# Altium schematic sheet MCU_Pins.SchDoc
size A4 portrait
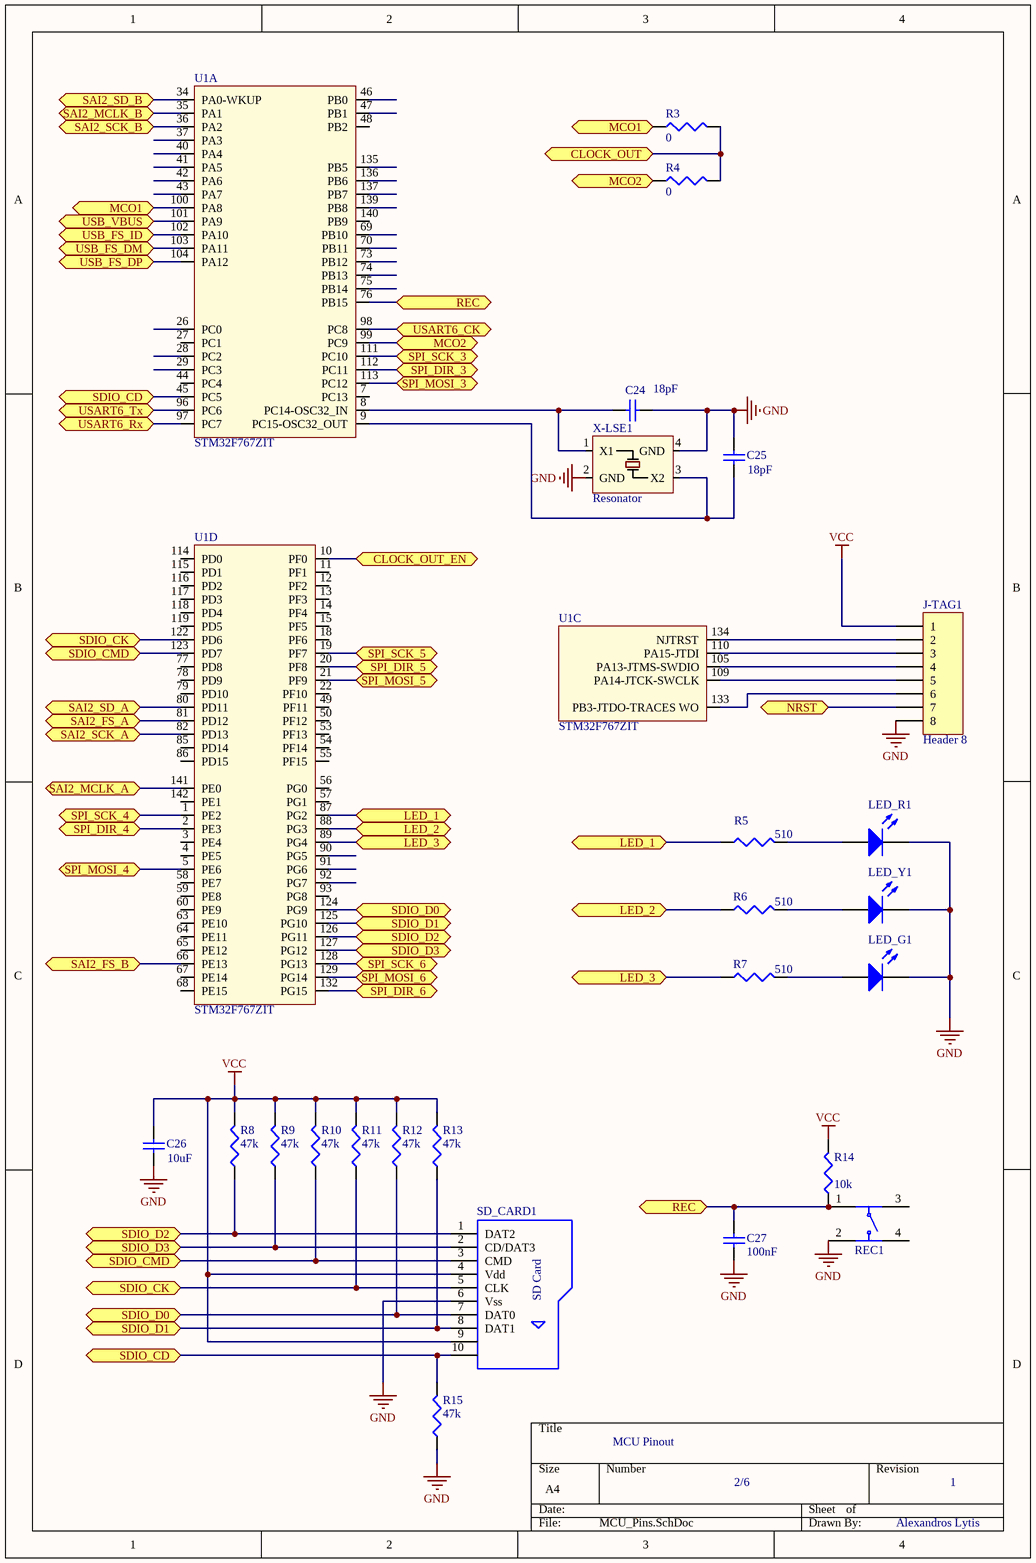
[diagram p0: MCU_Pins.SchDoc]

## Parts
C24  value 18pF  [CAP0603]  (hidden comment: Cap Semi)
C25  value 18pF  [CAP0603]  (hidden comment: Cap Semi)
C26  value 10uF  [CAP0603]  (hidden comment: Cap Semi)
C27  value 100nF  [CAP0603]  (hidden comment: Cap Semi)
J-TAG1  Header 8  [HDR1X8]
LED_G1  LED2  [1608[0603]]  (value not drawn)
LED_R1  LED2  [1608[0603]]  (value not drawn)
LED_Y1  LED2  [1608[0603]]  (value not drawn)
R3  value 0  [RES0603]  (hidden comment: Res3)
R4  value 0  [RES0603]  (hidden comment: Res3)
R5  value 510  [RES0603]  (hidden comment: Res3)
R6  value 510  [RES0603]  (hidden comment: Res3)
R7  value 510  [RES0603]  (hidden comment: Res3)
R8  value 47k  [RES0603]  (hidden comment: Res3)
R9  value 47k  [RES0603]  (hidden comment: Res3)
R10  value 47k  [RES0603]  (hidden comment: Res3)
R11  value 47k  [RES0603]  (hidden comment: Res3)
R12  value 47k  [RES0603]  (hidden comment: Res3)
R13  value 47k  [RES0603]  (hidden comment: Res3)
R14  value 10k  [RES0603]  (hidden comment: Res3)
R15  value 47k  [RES0603]  (hidden comment: Res3)
REC1  430152043826  [4301x20438x6]  (value not drawn)
SD_CARD1  693071010811  [693071010811]  (value not drawn)
U1  STM32F767ZIT  [TSQFP50P2200X2200X160-144N]  (parts A,C,D of 4)
X-LSE1  Resonator  [SOJ550P380X250-4M]

## Ports
CLOCK_OUT, CLOCK_OUT_EN, LED_1, LED_2, LED_3, MCO1, MCO2, NRST, REC, SAI2_FS_A, SAI2_FS_B, SAI2_MCLK_A, SAI2_MCLK_B, SAI2_SCK_A, SAI2_SCK_B, SAI2_SD_A, SAI2_SD_B, SDIO_CD, SDIO_CK, SDIO_CMD, SDIO_D0, SDIO_D1, SDIO_D2, SDIO_D3, SPI_DIR_3, SPI_DIR_4, SPI_DIR_5, SPI_DIR_6, SPI_MOSI_3, SPI_MOSI_4, SPI_MOSI_5, SPI_MOSI_6, SPI_SCK_3, SPI_SCK_4, SPI_SCK_5, SPI_SCK_6, USART6_CK, USART6_Rx, USART6_Tx, USB_FS_DM, USB_FS_DP, USB_FS_ID, USB_VBUS

## Nets
GND: C24.1 C25.1 C26.1 C27.1 J-TAG1.8 LED_G1.2(K) LED_R1.2(K) LED_Y1.2(K) R15.1 REC1.2 SD_CARD1.6(Vss) X-LSE1.2(GND) X-LSE1.4(GND)
VCC: C26.2 J-TAG1.1 R8.2 R9.2 R10.2 R11.2 R12.2 R13.2 R14.2 SD_CARD1.4(Vdd) SD_CARD1.9
CLOCK_OUT: R3.2 R4.2 ; port CLOCK_OUT
CLOCK_OUT_EN: U1.10(PF0) ; port CLOCK_OUT_EN
LED_1: R5.1 U1.87(PG2) ; port LED_1
LED_2: R6.1 U1.88(PG3) ; port LED_2
LED_3: R7.1 U1.89(PG4) ; port LED_3
MCO1: R3.1 U1.100(PA8) ; port MCO1
MCO2: R4.1 U1.99(PC9) ; port MCO2
NRST: J-TAG1.7 ; port NRST
REC: C27.2 R14.1 REC1.1 U1.76(PB15) ; port REC
SAI2_FS_A: U1.81(PD12) ; port SAI2_FS_A
SAI2_FS_B: U1.66(PE13) ; port SAI2_FS_B
SAI2_MCLK_A: U1.141(PE0) ; port SAI2_MCLK_A
SAI2_MCLK_B: U1.35(PA1) ; port SAI2_MCLK_B
SAI2_SCK_A: U1.82(PD13) ; port SAI2_SCK_A
SAI2_SCK_B: U1.36(PA2) ; port SAI2_SCK_B
SAI2_SD_A: U1.80(PD11) ; port SAI2_SD_A
SAI2_SD_B: U1.34(PA0-WKUP) ; port SAI2_SD_B
SDIO_CD: R15.2 SD_CARD1.10 U1.45(PC5) ; port SDIO_CD
SDIO_CK: R11.1 SD_CARD1.5(CLK) U1.122(PD6) ; port SDIO_CK
SDIO_CMD: R10.1 SD_CARD1.3(CMD) U1.123(PD7) ; port SDIO_CMD
SDIO_D0: R12.1 SD_CARD1.7(DAT0) U1.124(PG9) ; port SDIO_D0
SDIO_D1: R13.1 SD_CARD1.8(DAT1) U1.125(PG10) ; port SDIO_D1
SDIO_D2: R8.1 SD_CARD1.1(DAT2) U1.126(PG11) ; port SDIO_D2
SDIO_D3: R9.1 SD_CARD1.2(CD/DAT3) U1.127(PG12) ; port SDIO_D3
SPI_DIR_3: U1.112(PC11) ; port SPI_DIR_3
SPI_DIR_4: U1.2(PE3) ; port SPI_DIR_4
SPI_DIR_5: U1.20(PF8) ; port SPI_DIR_5
SPI_DIR_6: U1.132(PG15) ; port SPI_DIR_6
SPI_MOSI_3: U1.113(PC12) ; port SPI_MOSI_3
SPI_MOSI_4: U1.5(PE6) ; port SPI_MOSI_4
SPI_MOSI_5: U1.21(PF9) ; port SPI_MOSI_5
SPI_MOSI_6: U1.129(PG14) ; port SPI_MOSI_6
SPI_SCK_3: U1.111(PC10) ; port SPI_SCK_3
SPI_SCK_4: U1.1(PE2) ; port SPI_SCK_4
SPI_SCK_5: U1.19(PF7) ; port SPI_SCK_5
SPI_SCK_6: U1.128(PG13) ; port SPI_SCK_6
USART6_CK: U1.98(PC8) ; port USART6_CK
USART6_Rx: U1.97(PC7) ; port USART6_Rx
USART6_Tx: U1.96(PC6) ; port USART6_Tx
USB_FS_DM: U1.103(PA11) ; port USB_FS_DM
USB_FS_DP: U1.104(PA12) ; port USB_FS_DP
USB_FS_ID: U1.102(PA10) ; port USB_FS_ID
USB_VBUS: U1.101(PA9) ; port USB_VBUS
NetC24_2: C24.2 U1.8(PC14-OSC32_IN) X-LSE1.1(X1)
NetC25_2: C25.2 U1.9(PC15-OSC32_OUT) X-LSE1.3(X2)
NetJ-TAG1_2: J-TAG1.2 U1.134(NJTRST)
NetJ-TAG1_3: J-TAG1.3 U1.110(PA15-JTDI)
NetJ-TAG1_4: J-TAG1.4 U1.105(PA13-JTMS-SWDIO)
NetJ-TAG1_5: J-TAG1.5 U1.109(PA14-JTCK-SWCLK)
NetJ-TAG1_6: J-TAG1.6 U1.133(PB3-JTDO-TRACES_WO)
NetLED_G1_1: LED_G1.1(A) R7.2
NetLED_R1_1: LED_R1.1(A) R5.2
NetLED_Y1_1: LED_Y1.1(A) R6.2

Not connected (* = marked no-connect by the designer): REC1 3 4; U1 3(PE4) 4(PE5) 7(PC13) 11(PF1) 12(PF2) 13(PF3) 14(PF4) 15(PF5) 18(PF6) 22(PF10) 26(PC0) 27(PC1) 28(PC2) 29(PC3) 37(PA3) 40(PA4) 41(PA5) 42(PA6) 43(PA7) 44(PC4) 46(PB0) 47(PB1) 48(PB2) 49(PF11) 50(PF12) 53(PF13) 54(PF14) 55(PF15) 56(PG0) 57(PG1) 58(PE7) 59(PE8) 60(PE9) 63(PE10) 64(PE11) 65(PE12) 67(PE14) 68(PE15) 69(PB10) 70(PB11) 73(PB12) 74(PB13) 75(PB14) 77(PD8) 78(PD9) 79(PD10) 85(PD14) 86(PD15) 90(PG5) 91(PG6) 92(PG7) 93(PG8) 114(PD0) 115(PD1) 116(PD2) 117(PD3) 118(PD4) 119(PD5) 135(PB5) 136(PB6) 137(PB7) 139(PB8) 140(PB9) 142(PE1)

## Notes on the sheet
- MCU Pinout
- 2/6
- 1
- Alexandros Lytis
- (in symbol 693071010811) SD Card

## Library data of the parts
C24-C27 = Cap Semi: Capacitor (Semiconductor SIM Model); Published: 8-Jun-2000; LatestRevisionDate: 29-May-2009; LatestRevisionNote: IPC-7351 Footprint Added.; PackageReference: C1206; Publisher: Altium Limited; PackageDescription: Chip Capacitor
J-TAG1 = Header 8: Header, 8-Pin; LatestRevisionDate: 17-Jul-2002; LatestRevisionNote: Re-released for DXP Platform.; Publisher: Altium Limited
LED_G1 LED_R1 LED_Y1 = LED2: Typical RED, GREEN, YELLOW, AMBER GaAs LED; Published: 8-Jun-2000; LatestRevisionDate: 17-Jul-2002; LatestRevisionNote: Re-released for DXP Platform.; PackageVersion: Feb-2002; PackageReference: 3.2X1.6X1.1; Publisher: Altium Limited; PackageDescription: SM LED; 2 Flat Leads
R3-R15 = Res3: Resistor; Published: 8-Jun-2000; LatestRevisionDate: 29-May-2009; LatestRevisionNote: IPC-7351 Footprint Added.; PackageReference: J1-0603; Publisher: Altium Limited; PackageDescription: Chip Resistor
REC1 = WS-TASV, 430152043826: WS-TASV 6x6 mm SMD; Manufacturer: Wurth Elektronik; partNo: 430152043826; ComponentLink1Description: Manufacturer; ComponentLink1URL: http://www.we-online.de; Created by: Baojun Chen; Created Date: Dec.2015; ComponentLink2Description: Datasheet; ComponentLink2URL: http://katalog.we-online.de/em/datasheet/4301x2xxx8x6.pdf
SD_CARD1 = 693071010811: WR-CRD Micro SD Card Connector Push & Push - 8 pins; Published: June 2016; Publisher: Wurth Elektronik; ComponentLink1Description: Manufacturer; ComponentLink1URL: http://www.we-online.de; ComponentLink2Description: Datasheet; ComponentLink2URL: http://katalog.we-online.de/em/datasheet/693071010811.pdf; PartNumber: 693071010811
X-LSE1 = ABM8G-MHz